# EasyEDA Pro project Macro Pad.eprj

# Schematic Schematic1
Create Date: 2024-01-24; Page Name: P1; Project Name: Macro Pad; Schematic Name: Schematic1; Update Date: 2024-02-12; Company: AVT; Drawn: Tiebe Groosman; Page Size: A4; Part Number: 001; Version: V0.1
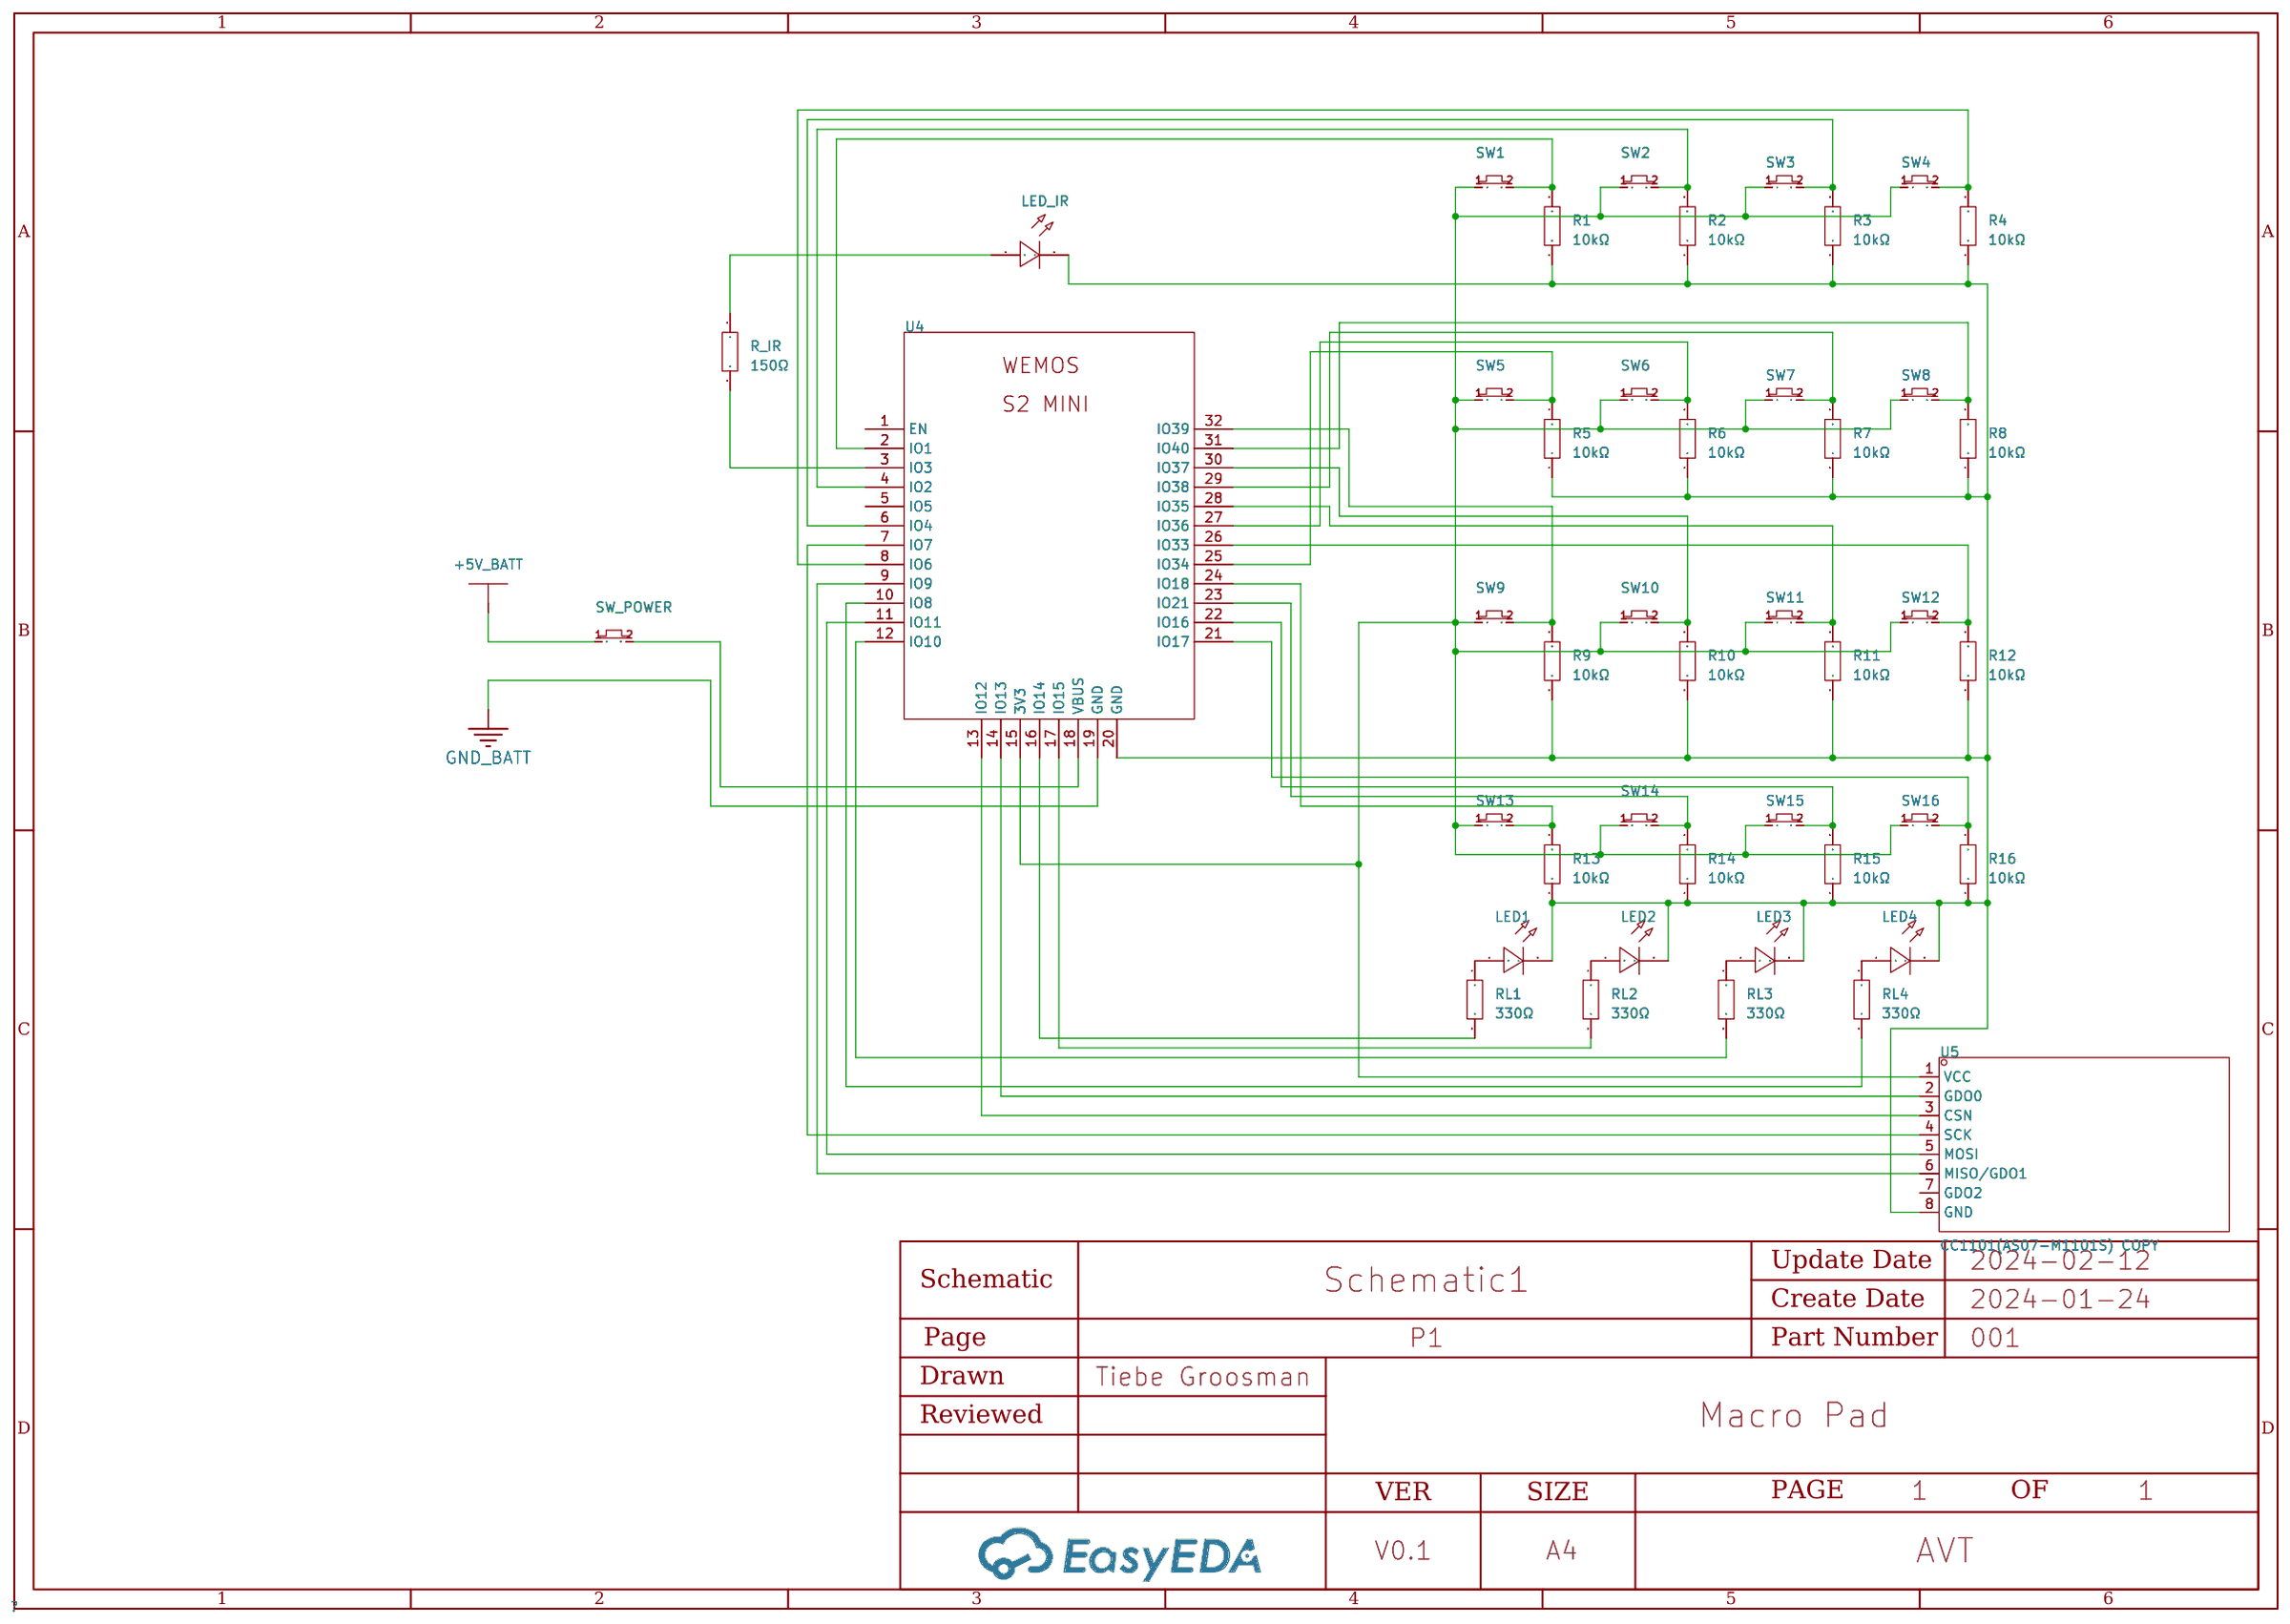
[diagram p0: schematic sheet]

## Parts
LED1  -  [LED-TH_BD5.8-P2.54-FD]
LED2  -  [LED-TH_BD5.8-P2.54-FD]
LED3  -  [LED-TH_BD5.8-P2.54-FD]
LED4  -  [LED-TH_BD5.8-P2.54-FD]
LED_IR  -  [LED-TH_BD5.8-P2.54-FD]
R1  10kΩ  [RES-TH_BD1.8-L3.2-P7.20-D0.4]
R2  10kΩ  [RES-TH_BD1.8-L3.2-P7.20-D0.4]
R3  10kΩ  [RES-TH_BD1.8-L3.2-P7.20-D0.4]
R4  10kΩ  [RES-TH_BD1.8-L3.2-P7.20-D0.4]
R5  10kΩ  [RES-TH_BD1.8-L3.2-P7.20-D0.4]
R6  10kΩ  [RES-TH_BD1.8-L3.2-P7.20-D0.4]
R7  10kΩ  [RES-TH_BD1.8-L3.2-P7.20-D0.4]
R8  10kΩ  [RES-TH_BD1.8-L3.2-P7.20-D0.4]
R9  10kΩ  [RES-TH_BD1.8-L3.2-P7.20-D0.4]
R10  10kΩ  [RES-TH_BD1.8-L3.2-P7.20-D0.4]
R11  10kΩ  [RES-TH_BD1.8-L3.2-P7.20-D0.4]
R12  10kΩ  [RES-TH_BD1.8-L3.2-P7.20-D0.4]
R13  10kΩ  [RES-TH_BD1.8-L3.2-P7.20-D0.4]
R14  10kΩ  [RES-TH_BD1.8-L3.2-P7.20-D0.4]
R15  10kΩ  [RES-TH_BD1.8-L3.2-P7.20-D0.4]
R16  10kΩ  [RES-TH_BD1.8-L3.2-P7.20-D0.4]
R_IR  150Ω  [RES-TH_BD1.8-L3.2-P7.20-D0.4]
RL1  330Ω  [RES-TH_BD1.8-L3.2-P7.20-D0.4]
RL2  330Ω  [RES-TH_BD1.8-L3.2-P7.20-D0.4]
RL3  330Ω  [RES-TH_BD1.8-L3.2-P7.20-D0.4]
RL4  330Ω  [RES-TH_BD1.8-L3.2-P7.20-D0.4]
SW1  BUTTON-2PIN COPY  [BUTTON-2PIN]
SW2  BUTTON-2PIN COPY  [BUTTON-2PIN]
SW3  BUTTON-2PIN COPY  [BUTTON-2PIN]
SW4  BUTTON-2PIN COPY  [BUTTON-2PIN]
SW5  BUTTON-2PIN COPY  [BUTTON-2PIN]
SW6  BUTTON-2PIN COPY  [BUTTON-2PIN]
SW7  BUTTON-2PIN COPY  [BUTTON-2PIN]
SW8  BUTTON-2PIN COPY  [BUTTON-2PIN]
SW9  BUTTON-2PIN COPY  [BUTTON-2PIN]
SW10  BUTTON-2PIN COPY  [BUTTON-2PIN]
SW11  BUTTON-2PIN COPY  [BUTTON-2PIN]
SW12  BUTTON-2PIN COPY  [BUTTON-2PIN]
SW13  BUTTON-2PIN COPY  [BUTTON-2PIN]
SW14  BUTTON-2PIN COPY  [BUTTON-2PIN]
SW15  BUTTON-2PIN COPY  [BUTTON-2PIN]
SW16  BUTTON-2PIN COPY  [BUTTON-2PIN]
SW_POWER  BUTTON-2PIN COPY  [BUTTON-2PIN]
U4  WEMOS S2 MINI COPY  [WEMOS-S2-MINI]
U5  CC1101(AS07-M1101S) COPY  [CC1101(AS07-M1101S)]

## Library data of the parts
LED1-LED4 LED_IR = LED_TH-R_5mm: Supplier Footprint: Through
R1-R16 R_IR RL1-RL4 = Res_AXIAL-1/8W: Supplier Footprint: Through
SW1-SW16 SW_POWER = BUTTON-2PIN COPY: Supplier Part: C71836; Manufacturer: BBJ; Manufacturer Part: Switch,6*6*6Plastic head,260G, 0.25mm,Straight line
U4 = WEMOS S2 MINI COPY: Manufacturer: WEMOS; Manufacturer Part: Wemos; Supplier: WEMOS; Supplier Part: WEMOS_S2_MINI; link: https://www.wemos.cc/en/latest/s2/s2_mini.html?spm=a2g0o.detail.1000023.1.36da1596ZoDwKF
U5 = CC1101(AS07-M1101S) COPY

## Nets
+5V_BATT: SW_POWER.1
GND_BATT: U4.19(GND)
$1N13801: LED_IR.1(C) R_IR.1
$1N17024: LED1.1(C) RL1.1
$1N17244: LED2.1(C) RL2.1
$1N17270: LED3.1(C) RL3.1
$1N17296: LED4.1(C) RL4.1
Net-(LED1-2): LED1.2(A) LED2.2(A) LED3.2(A) LED4.2(A) LED_IR.2(A) R1.1 R2.1 R3.1 R4.1 R5.1 R6.1 R7.1 R8.1 R9.1 R10.1 R11.1 R12.1 R13.1 R14.1 R15.1 R16.1 U4.20(GND) U5.8(GND)
Net-(R1-2): R1.2 SW1.2(3) U4.2(IO1)
Net-(R2-2): R2.2 SW2.2(3) U4.4(IO2)
Net-(R3-2): R3.2 SW3.2(3) U4.6(IO4)
Net-(R4-2): R4.2 SW4.2(3) U4.8(IO6)
Net-(R5-2): R5.2 SW5.2(3) U4.25(IO34)
Net-(R6-2): R6.2 SW6.2(3) U4.27(IO36)
Net-(R7-2): R7.2 SW7.2(3) U4.29(IO38)
Net-(R8-2): R8.2 SW8.2(3) U4.31(IO40)
Net-(R9-2): R9.2 SW9.2(3) U4.32(IO39)
Net-(R10-2): R10.2 SW10.2(3) U4.30(IO37)
Net-(R11-2): R11.2 SW11.2(3) U4.28(IO35)
Net-(R12-2): R12.2 SW12.2(3) U4.26(IO33)
Net-(R13-2): R13.2 SW13.2(3) U4.24(IO18)
Net-(R14-2): R14.2 SW14.2(3) U4.23(IO21)
Net-(R15-2): R15.2 SW15.2(3) U4.22(IO16)
Net-(R16-2): R16.2 SW16.2(3) U4.21(IO17)
Net-(R_IR-2): R_IR.2 U4.3(IO3)
Net-(RL1-2): RL1.2 U4.16(IO14)
Net-(RL2-2): RL2.2 U4.17(IO15)
Net-(RL3-2): RL3.2 U4.12(IO10)
Net-(RL4-2): RL4.2 U4.10(IO8)
Net-(SW1-1): SW1.1 SW2.1 SW3.1 SW4.1 SW5.1 SW6.1 SW7.1 SW8.1 SW9.1 SW10.1 SW11.1 SW12.1 SW13.1 SW14.1 SW15.1 SW16.1 U4.15(3V3) U5.1(VCC)
Net-(SW_POWER-2): SW_POWER.2(3) U4.18(VBUS)
Net-(U4-7): U4.7(IO7) U5.4(SCK)
Net-(U4-9): U4.9(IO9) U5.6(MISO/GDO1)
Net-(U4-11): U4.11(IO11) U5.5(MOSI)
Net-(U4-13): U4.13(IO12) U5.3(CSN)
Net-(U4-14): U4.14(IO13) U5.2(GDO0)

Not connected (* = marked no-connect by the designer): U4 1(EN) 5(IO5); U5 7(GDO2)

# Board PCB3
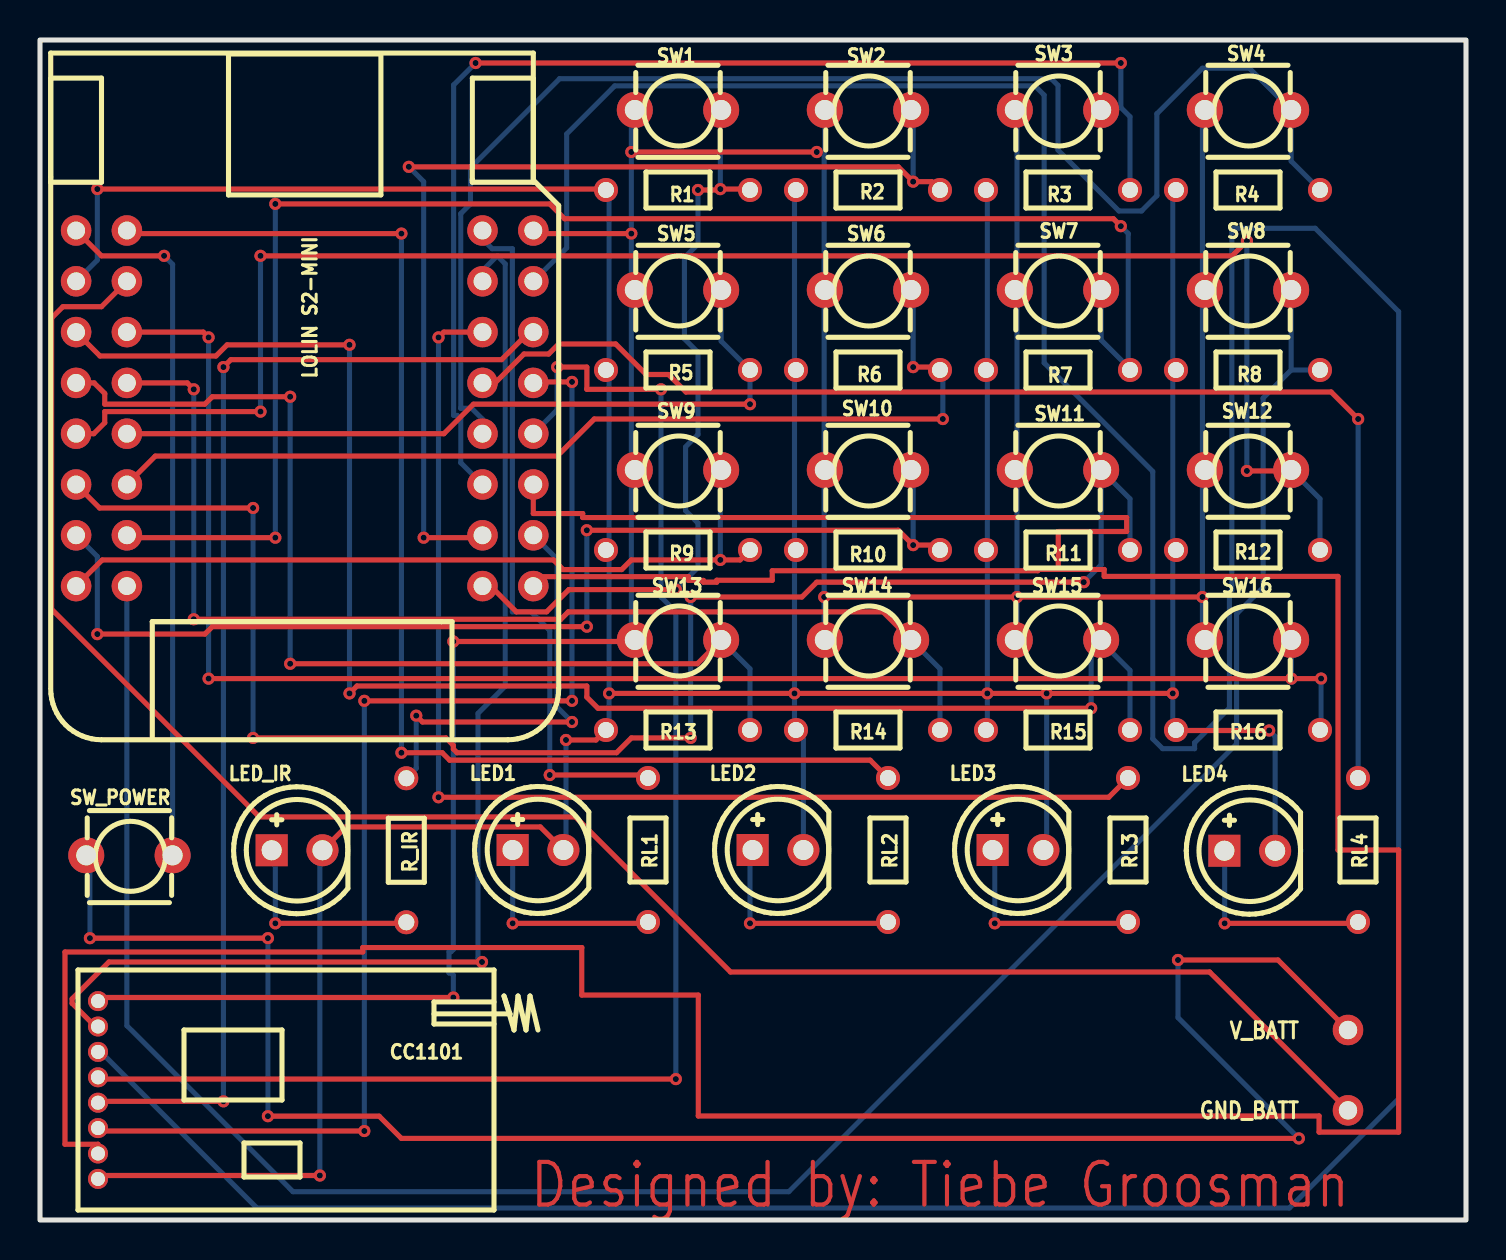
[diagram p1: board, top side]
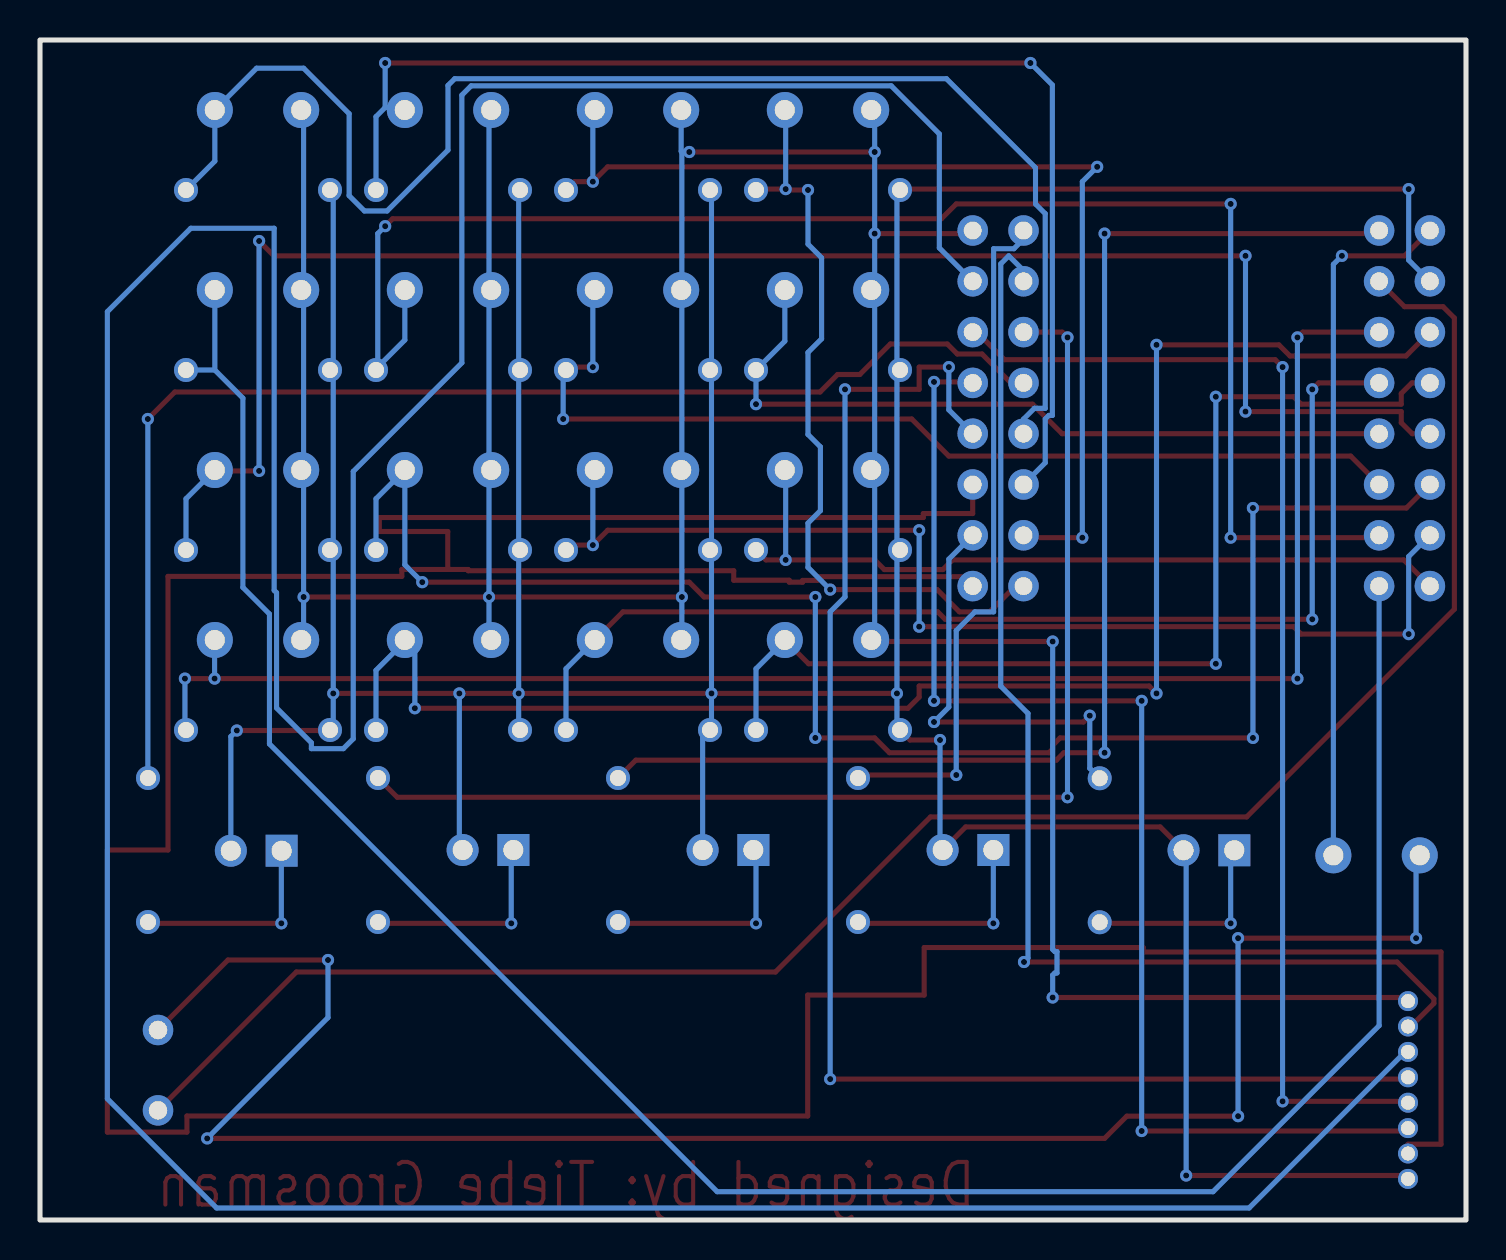
[diagram p2: board, bottom side, seen from below]

Outline 71.3 x 59 mm; copper layers: Top Layer, Bottom Layer. Coordinates in mm from the lower left corner of the outline.
Outline path: rectangle 0,59 71.3,0
Stack: Top Layer 0.035mm / Dielectric1 1.51mm FR4 er 4.5 / Bottom Layer 0.035mm

## Design rules (mm)
template: JLCPCB Capability(Two Layers Board)
spacing copperThickness1oz (default): track to track 0.102, other pairs 0.152 to 0.3
spacing copperThickness2oz: track to track 0.203, other pairs 0.152 to 0.3
track width copperThickness1oz (default): min 0.127, default 0.254, max 2.54
track width copperThickness2oz: min 0.203, default 0.254, max 2.54
differential pair differentialPair (default): width min 0.127, default 0.254, max 2.54; gap min 0.152, default 0.152
via viaSize (default): diameter min 0.5, default 0.61, max 10; hole min 0.3, default 0.305, max 6.3

## Placement (name value [footprint] x y rotation side)
CC1101  CC1101(AS07-M1101S) COPY  [CC1101(AS07-M1101S)]  2.9 6.5 0 top
LED1  -  [LED-TH_BD5.8-P2.54-FD]  24.9 18.5 0 top
LED2  -  [LED-TH_BD5.8-P2.54-FD]  36.9 18.5 0 top
LED3  -  [LED-TH_BD5.8-P2.54-FD]  48.9 18.5 0 top
LED4  -  [LED-TH_BD5.8-P2.54-FD]  60.49 18.46 0 top
LED_IR  -  [LED-TH_BD5.8-P2.54-FD]  12.85 18.49 0 top
LOLIN S2-MINI  WEMOS S2 MINI COPY  [WEMOS-S2-MINI]  13.23 39.06 180 top
NOREF  -  [Pad_e85]  65.4 9.5 0 top
NOREF#2  -  [Pad_e86]  65.4 5.48 0 top
R1  10kΩ  [RES-TH_BD1.8-L3.2-P7.20-D0.4]  31.9 51.5 0 top
R2  10kΩ  [RES-TH_BD1.8-L3.2-P7.20-D0.4]  41.4 51.5 0 top
R3  10kΩ  [RES-TH_BD1.8-L3.2-P7.20-D0.4]  50.9 51.5 0 top
R4  10kΩ  [RES-TH_BD1.8-L3.2-P7.20-D0.4]  60.4 51.5 0 top
R5  10kΩ  [RES-TH_BD1.8-L3.2-P7.20-D0.4]  31.9 42.5 0 top
R6  10kΩ  [RES-TH_BD1.8-L3.2-P7.20-D0.4]  41.4 42.5 0 top
R7  10kΩ  [RES-TH_BD1.8-L3.2-P7.20-D0.4]  50.9 42.5 0 top
R8  10kΩ  [RES-TH_BD1.8-L3.2-P7.20-D0.4]  60.4 42.5 0 top
R9  10kΩ  [RES-TH_BD1.8-L3.2-P7.20-D0.4]  31.9 33.5 0 top
R10  10kΩ  [RES-TH_BD1.8-L3.2-P7.20-D0.4]  41.4 33.5 0 top
R11  10kΩ  [RES-TH_BD1.8-L3.2-P7.20-D0.4]  50.9 33.5 0 top
R12  10kΩ  [RES-TH_BD1.8-L3.2-P7.20-D0.4]  60.4 33.5 0 top
R13  10kΩ  [RES-TH_BD1.8-L3.2-P7.20-D0.4]  31.9 24.5 0 top
R14  10kΩ  [RES-TH_BD1.8-L3.2-P7.20-D0.4]  41.4 24.5 0 top
R15  10kΩ  [RES-TH_BD1.8-L3.2-P7.20-D0.4]  50.9 24.5 0 top
R16  10kΩ  [RES-TH_BD1.8-L3.2-P7.20-D0.4]  60.4 24.5 0 top
R_IR  150Ω  [RES-TH_BD1.8-L3.2-P7.20-D0.4]  18.31 18.49 90 top
RL1  330Ω  [RES-TH_BD1.8-L3.2-P7.20-D0.4]  30.4 18.5 90 top
RL2  330Ω  [RES-TH_BD1.8-L3.2-P7.20-D0.4]  42.4 18.5 90 top
RL3  330Ω  [RES-TH_BD1.8-L3.2-P7.20-D0.4]  54.4 18.5 90 top
RL4  330Ω  [RES-TH_BD1.8-L3.2-P7.20-D0.4]  65.9 18.5 90 top
SW1  BUTTON-2PIN COPY  [BUTTON-2PIN]  31.9 55.5 0 top
SW2  BUTTON-2PIN COPY  [BUTTON-2PIN]  41.4 55.5 0 top
SW3  BUTTON-2PIN COPY  [BUTTON-2PIN]  50.9 55.5 0 top
SW4  BUTTON-2PIN COPY  [BUTTON-2PIN]  60.4 55.5 0 top
SW5  BUTTON-2PIN COPY  [BUTTON-2PIN]  31.9 46.5 0 top
SW6  BUTTON-2PIN COPY  [BUTTON-2PIN]  41.4 46.5 0 top
SW7  BUTTON-2PIN COPY  [BUTTON-2PIN]  50.9 46.5 0 top
SW8  BUTTON-2PIN COPY  [BUTTON-2PIN]  60.4 46.5 0 top
SW9  BUTTON-2PIN COPY  [BUTTON-2PIN]  31.9 37.5 0 top
SW10  BUTTON-2PIN COPY  [BUTTON-2PIN]  41.4 37.5 0 top
SW11  BUTTON-2PIN COPY  [BUTTON-2PIN]  50.9 37.5 0 top
SW12  BUTTON-2PIN COPY  [BUTTON-2PIN]  60.4 37.5 0 top
SW13  BUTTON-2PIN COPY  [BUTTON-2PIN]  31.9 29 0 top
SW14  BUTTON-2PIN COPY  [BUTTON-2PIN]  41.4 29 0 top
SW15  BUTTON-2PIN COPY  [BUTTON-2PIN]  50.9 29 0 top
SW16  BUTTON-2PIN COPY  [BUTTON-2PIN]  60.4 29 0 top
SW_POWER  BUTTON-2PIN COPY  [BUTTON-2PIN]  4.47 18.23 0 top

## Footprints (pads in the part's own frame, mm; a bottom-side part is the same pattern mirrored in y, then rotated)
BUTTON-2PIN
  round 1.8 hole 1: 1(-2.159,0) 2(2.159,0)
CC1101(AS07-M1101S)
  round 1 hole 0.7: 1(0,4.445) 2(0,3.175) 3(0,1.905) 4(0,0.635) 5(0,-0.635) 6(0,-1.905) 7(0,-3.175) 8(0,-4.445)
LED-TH_BD5.8-P2.54-FD
  rect 1.6x1.6 hole 1: 1(-1.27,0)
  round 1.6 hole 1: 2(1.27,0)
Pad_e85
  round 1.524 hole 0.914: 1(0,0)
Pad_e86
  round 1.524 hole 0.914: 34(0,0)
RES-TH_BD1.8-L3.2-P7.20-D0.4
  round 1.2 hole 0.8: 1(-3.6,0) 2(3.6,0)
WEMOS-S2-MINI
  round 1.524 hole 0.889: 1(-11.43,7.366) 2(-8.89,7.366) 3(-11.43,4.826) 4(-8.89,4.826) 5(-11.43,2.286) 6(-8.89,2.286) 7(-11.43,-0.254) 8(-8.89,-0.254) 9(-11.43,-2.794) 10(-8.89,-2.794) 11(-11.43,-5.334) 12(-8.89,-5.334) 13(-11.43,-7.874) 14(-8.89,-7.874) 15(-11.43,-10.414) 16(-8.89,-10.414) 17(8.89,-10.414) 18(11.43,-10.414) 19(8.89,-7.874) 20(11.43,-7.874) 21(8.89,-5.334) 22(11.43,-5.334) 23(8.89,-2.794) 24(11.43,-2.794) 25(8.89,-0.254) 26(11.43,-0.254) 27(8.89,2.286) 28(11.43,2.286) 29(8.89,4.826) 30(11.43,4.826) 31(8.89,7.366) 32(11.43,7.366)

## Nets
+5V_BATT: NOREF.1 SW_POWER.1
GND_BATT: LOLIN S2-MINI.19 NOREF#2.34
$1N7799: LOLIN S2-MINI.4 R2.2 SW2.2
$1N9635: LOLIN S2-MINI.2 R1.2 SW1.2
$1N11708: LOLIN S2-MINI.8 R4.2 SW4.2
$1N11715: LOLIN S2-MINI.6 R3.2 SW3.2
$1N12469: LOLIN S2-MINI.27 R6.2 SW6.2
$1N12477: LOLIN S2-MINI.25 R5.2 SW5.2
$1N12492: LOLIN S2-MINI.31 R8.2 SW8.2
$1N12495: LOLIN S2-MINI.29 R7.2 SW7.2
$1N13243: LOLIN S2-MINI.30 R10.2 SW10.2
$1N13251: LOLIN S2-MINI.32 R9.2 SW9.2
$1N13266: LOLIN S2-MINI.26 R12.2 SW12.2
$1N13269: LOLIN S2-MINI.28 R11.2 SW11.2
$1N13801: LED_IR.1 R_IR.1
$1N13802: LOLIN S2-MINI.3 R_IR.2
$1N14432: LOLIN S2-MINI.18 SW_POWER.2
$1N15226: CC1101.2 LOLIN S2-MINI.14
$1N15246: CC1101.3 LOLIN S2-MINI.13
$1N15263: CC1101.4 LOLIN S2-MINI.7
$1N15276: CC1101.5 LOLIN S2-MINI.11
$1N15287: CC1101.6 LOLIN S2-MINI.9
$1N16205: CC1101.1 LOLIN S2-MINI.15 SW1.1 SW2.1 SW3.1 SW4.1 SW5.1 SW6.1 SW7.1 SW8.1 SW9.1 SW10.1 SW11.1 SW12.1 SW13.1 SW14.1 SW15.1 SW16.1
$1N16367: LOLIN S2-MINI.24 R13.2 SW13.2
$1N16374: LOLIN S2-MINI.23 R14.2 SW14.2
$1N16381: LOLIN S2-MINI.22 R15.2 SW15.2
$1N16388: LOLIN S2-MINI.21 R16.2 SW16.2
$1N17024: LED1.1 RL1.1
$1N17106: LOLIN S2-MINI.16 RL1.2
$1N17110: LOLIN S2-MINI.17 RL2.2
$1N17210: LOLIN S2-MINI.12 RL3.2
$1N17216: LOLIN S2-MINI.10 RL4.2
$1N17244: LED2.1 RL2.1
$1N17270: LED3.1 RL3.1
$1N17296: LED4.1 RL4.1
$1N17346: CC1101.8 LED1.2 LED2.2 LED3.2 LED4.2 LED_IR.2 LOLIN S2-MINI.20 R1.1 R2.1 R3.1 R4.1 R5.1 R6.1 R7.1 R8.1 R9.1 R10.1 R11.1 R12.1 R13.1 R14.1 R15.1 R16.1

Pads without a net: CC1101 7; LOLIN S2-MINI 1 5

## Via types
v1: diameter 0.61, hole 0.305, Top Layer to Bottom Layer, 85 vias

## Routing (per net, layer and track width the routed paths; a pad name or vN(x,y) marks a point on that pad's centre or on a via; arc(x,y) is an arc through that point)
+5V_BATT: length 95.4
  Top Layer w0.254: v1(11.4,5.19) 16.96,5.19 18.07,4.08 v1(62.94,4.08) ; NOREF.1 61.9,13 v1(56.9,13) ; v1(11.4,14.09) v1(2.5,14.09)
  Bottom Layer w0.254: v1(11.4,5.19) v1(11.4,14.09) ; v1(62.94,4.08) 56.9,10.12 v1(56.9,13) ; v1(2.5,14.09) 2.5,18.05 SW_POWER.1
GND_BATT: length 94.3
  Top Layer w0.254: LOLIN S2-MINI.19 3.08,45.67 1.15,45.67 0.58,45.1 0.58,30.54 10.97,20.15 26.77,20.15 34.53,12.4 58.48,12.4 NOREF#2.34
(no net): length 198
  Top Layer w0.254: LOLIN S2-MINI.1 24.66,32.17 32.43,32.17 32.43,31.98 33.17,31.98 33.17,31.89 33.84,31.89 33.84,31.99 36.61,31.99 36.61,32.46 49.89,32.46 49.89,32.53 50.91,32.53 ; 50.91,32.53 53.21,32.53 53.21,32.18 64.9,32.18 64.9,18.5 67.93,18.5 67.93,4.4 63.95,4.4 63.95,5.2 32.91,5.2 32.91,11.25 27.09,11.25 27.09,13.62 16.14,13.62 16.14,13.4 1.25,13.4 1.25,3.79 2.9,3.79 CC1101.7 ; 50.91,32.53 50.91,34.42 54.33,34.42 54.33,35.12 27.13,35.12 27.13,35.32 24.66,35.32 LOLIN S2-MINI.5
$1N7799: length 52.5
  Top Layer w0.254: R2.2 44.58,51.92 v1(43.66,51.92) 42.92,52.66 v1(18.44,52.66) ; v1(19.18,34.12) 22.01,34.12 LOLIN S2-MINI.4
  Bottom Layer w0.254: v1(18.44,52.66) 19.18,51.92 v1(19.18,34.12) ; SW2.2 43.66,55.4 v1(43.66,51.92)
$1N9635: length 38.8
  Top Layer w0.254: LOLIN S2-MINI.2 22.53,31.69 23.82,30.41 25.33,30.41 26.44,31.52 v1(31.79,31.52) ; v1(32.9,51.5) 33.97,51.5 v1(34.02,51.55) 35.45,51.55 R1.2
  Bottom Layer w0.254: SW1.2 34.02,55.46 v1(34.02,51.55) ; v1(32.9,51.5) 32.9,48.79 32.22,48.11 32.22,44.06 32.9,43.38 32.9,39.28 32.28,38.66 32.28,35.47 32.9,34.84 32.9,32.63 v1(31.79,31.52)
$1N11708: length 72.6
  Bottom Layer w0.254: LOLIN S2-MINI.8 22.12,40.04 21.58,40.58 21.04,40.58 21.04,50.32 21.52,50.8 21.52,52.61 25.98,57.06 50.56,57.06 50.9,56.73 50.9,53.5 53.95,50.45 55.08,50.45 55.84,51.22 55.84,55.31 58.12,57.59 60.47,57.59 SW4.2 62.56,52.94 R4.2
$1N11715: length 62.1
  Top Layer w0.254: v1(54.04,57.85) v1(21.78,57.85)
  Bottom Layer w0.254: 54.04,55.62 53.18,55.62 SW3.2 ; 54.04,55.62 54.5,55.17 R3.2 ; 54.04,55.62 v1(54.04,57.85) ; LOLIN S2-MINI.6 21.04,37.86 21.04,40.05 20.86,40.23 20.68,40.23 20.68,56.75 v1(21.78,57.85)
$1N12469: length 50
  Top Layer w0.254: v1(45.14,40.05) 27.71,40.05 25.86,38.2 5.77,38.2 LOLIN S2-MINI.27 ; R6.2 44.85,42.65 v1(43.66,42.65)
  Bottom Layer w0.254: v1(43.66,42.65) 43.66,46.4 SW6.2 ; v1(45.14,40.05) 45.14,42.36 R6.2
$1N12477: length 38.1
  Top Layer w0.254: LOLIN S2-MINI.25 20.2,39.31 21.67,40.79 v1(35.5,40.79)
  Bottom Layer w0.254: SW5.2 34.06,43.94 R5.2 v1(35.5,40.79)
$1N12492: length 115.4
  Bottom Layer w0.254: LOLIN S2-MINI.31 4.34,9.72 12.65,1.41 37.44,1.41 59.83,23.8 59.83,30.3 61.16,31.63 61.16,41.1 62.56,42.5 ; 62.56,42.5 SW8.2 ; 62.56,42.5 R8.2
$1N12495: length 78.7
  Top Layer w0.254: LOLIN S2-MINI.29 4.46,34.12 v1(11.77,34.12) ; v1(54.04,49.69) 53.67,50.06 26.23,50.06 25.49,50.8 v1(11.77,50.8)
  Bottom Layer w0.254: SW7.2 53.06,44 54.41,42.65 ; v1(54.04,49.69) 54.41,49.32 54.41,42.65 ; v1(11.77,50.8) v1(11.77,34.12) ; 54.41,42.65 54.5,42.56 R7.2
$1N13243: length 56.7
  Top Layer w0.254: v1(27.34,29.67) 8.61,29.67 8.24,29.3 v1(2.87,29.3) ; v1(27.34,34.49) 42.92,34.49 v1(43.66,33.75) 44.75,33.75 R10.2
  Bottom Layer w0.254: v1(27.34,34.49) v1(27.34,29.67) ; v1(2.87,29.3) 2.87,33.17 LOLIN S2-MINI.30 ; v1(43.66,33.75) 43.66,37.4 SW10.2
$1N13251: length 39.4
  Top Layer w0.254: LOLIN S2-MINI.32 3.11,33 25.67,33 26.16,32.52 29.08,32.52 29.57,33 v1(34.02,33) 35,33 R9.2
  Bottom Layer w0.254: v1(34.02,33) 34.02,37.46 SW9.2
$1N13266: length 85.7
  Top Layer w0.254: v1(11.03,48.21) 59.6,48.21 v1(60.35,48.95) ; SW12.2 62.51,37.45 v1(60.35,37.45) ; LOLIN S2-MINI.26 2.69,39.31 3.24,39.86 3.24,40.42 v1(11.03,40.42)
  Bottom Layer w0.254: v1(60.35,37.45) v1(60.35,48.95) ; SW12.2 64,36.06 R12.2 ; v1(11.03,48.21) v1(11.03,40.42)
$1N13269: length 81
  Top Layer w0.254: v1(32.53,31.15) 38.1,31.15 38.84,31.89 v1(52.19,31.89) ; v1(10.65,24.1) 20.3,24.1 20.67,23.73 20.67,23.55 20.85,23.36 28.83,23.36 29.57,24.1 v1(32.53,24.1) ; v1(10.65,35.6) 2.98,35.6 LOLIN S2-MINI.28
  Bottom Layer w0.254: v1(32.53,31.15) v1(32.53,24.1) ; R11.2 54.5,36.06 SW11.2 53.06,32.76 v1(52.19,31.89) ; v1(10.65,24.1) v1(10.65,35.6)
$1N13801: length 10.3
  Top Layer w0.254: R_IR.1 18.26,14.83 v1(11.77,14.83)
  Bottom Layer w0.254: LED_IR.1 11.77,18.3 v1(11.77,14.83)
$1N13802: length 21.4
  Top Layer w0.254: v1(26.6,24.9) 19.13,24.9 v1(18.81,25.22)
  Bottom Layer w0.254: LOLIN S2-MINI.3 25.86,33.04 25.86,25.64 v1(26.6,24.9) ; 18.31,22.09 18.81,22.58 v1(18.81,25.22)
$1N14432: length 35.1
  Top Layer w0.254: LOLIN S2-MINI.18 3.07,48.21 v1(6.2,48.21)
  Bottom Layer w0.254: v1(6.2,48.21) 6.63,47.78 SW_POWER.2
$1N15226: length 61
  Top Layer w0.254: CC1101.2 2.76,9.68 1.61,10.83 1.61,11.06 3.45,12.9 v1(22.1,12.9)
  Bottom Layer w0.254: LOLIN S2-MINI.14 22.12,47.47 22.86,48.21 23.26,47.8 23.26,26.69 21.9,25.33 21.9,13.1 v1(22.1,12.9)
$1N15246: length 216.6
  Bottom Layer w0.254: CC1101.3 3.04,8.41 10.84,0.6 62.47,0.6 67.93,6.06 67.93,45.42 63.76,49.59 59.59,49.59 59.59,31.48 59.47,31.36 59.47,25.6 57.73,23.86 57.73,23.57 56.13,23.57 55.64,24.06 55.64,37.43 50.21,42.86 50.21,56.24 49.74,56.71 28.74,56.71 26.33,54.3 26.33,48.6 LOLIN S2-MINI.13
$1N15263: length 73.9
  Top Layer w0.254: v1(31.79,7.05) 2.99,7.05 CC1101.4 ; v1(25.86,42.65) 27.34,42.65 27.34,41.53 v1(31.05,41.53)
  Bottom Layer w0.254: v1(31.05,41.53) 31.05,31.15 31.79,30.41 v1(31.79,7.05) ; v1(25.86,42.65) 25.86,40.51 LOLIN S2-MINI.7
$1N15276: length 59.2
  Top Layer w0.254: LOLIN S2-MINI.11 24.46,44.39 23.08,43.02 9.54,43.02 v1(9.17,42.65) ; CC1101.5 2.97,5.93 v1(9.17,5.93)
  Bottom Layer w0.254: v1(9.17,42.65) v1(9.17,5.93)
$1N15287: length 63.2
  Top Layer w0.254: LOLIN S2-MINI.9 24.71,41.9 v1(26.6,41.9) ; CC1101.6 3.05,4.45 v1(16.22,4.45) ; v1(26.6,25.96) v1(16.22,25.96)
  Bottom Layer w0.254: v1(26.6,41.9) v1(26.6,25.96) ; v1(16.22,25.96) v1(16.22,4.45)
$1N16205: length 185.8
  Top Layer w0.254: v1(58.12,31.15) v1(48.85,31.15) v1(39.21,31.15) ; SW13.1 29.67,28.92 v1(20.67,28.92) ; v1(20.67,11.12) 3.08,11.12 CC1101.1 ; v1(29.57,49.32) 24.82,49.32 LOLIN S2-MINI.15 ; v1(38.84,53.4) v1(29.57,53.4)
  Bottom Layer w0.254: 58.12,37.5 v1(58.12,31.15) 58.12,29.12 SW16.1 ; 58.12,37.5 SW12.1 ; 58.12,37.5 58.12,46.5 ; SW1.1 29.57,55.33 v1(29.57,53.4) v1(29.57,49.32) 29.57,46.5 ; 48.85,46.5 48.85,37.5 ; 48.85,46.5 SW7.1 ; 48.85,46.5 48.85,55.39 SW3.1 ; 48.85,37.5 v1(48.85,31.15) 48.85,29.11 SW15.1 ; 48.85,37.5 SW11.1 ; 39.21,37.5 v1(39.21,31.15) 39.21,29.03 SW14.1 ; 39.21,37.5 39.21,46.5 ; 39.21,37.5 SW10.1 ; SW2.1 39.24,53.43 39.21,53.4 ; v1(20.67,28.92) 20.67,13.53 20.56,13.42 20.45,13.42 20.45,12.35 20.56,12.35 20.67,12.24 v1(20.67,11.12) ; SW8.1 58.12,46.5 ; 58.12,46.5 58.12,55.38 SW4.1 ; SW13.1 29.57,29.17 29.57,37.5 ; SW9.1 29.57,37.5 ; 29.57,37.5 29.57,46.5 ; SW6.1 39.21,46.5 ; 39.21,46.5 39.21,53.4 ; 39.21,53.4 v1(38.84,53.4) ; 29.57,46.5 SW5.1
$1N16367: length 52.1
  Top Layer w0.254: SW13.2 32.87,27.81 v1(12.51,27.81) ; v1(12.51,41.16) 8.61,41.16 8.24,40.79 3.24,40.79 3.24,41.32 2.71,41.86 LOLIN S2-MINI.24
  Bottom Layer w0.254: SW13.2 35.5,27.56 R13.2 ; v1(12.51,27.81) v1(12.51,41.16)
$1N16374: length 56.7
  Top Layer w0.254: v1(7.69,41.53) 7.37,41.86 LOLIN S2-MINI.23 ; v1(7.69,30.04) 26.04,30.04 26.41,30.41 42.15,30.41 SW14.2
  Bottom Layer w0.254: R14.2 45,27.56 SW14.2 ; v1(7.69,30.04) v1(7.69,41.53)
$1N16381: length 78.5
  Top Layer w0.254: v1(15.48,43.76) 9.36,43.76 8.8,43.2 3,43.2 LOLIN S2-MINI.22 ; v1(52.56,25.59) 27.9,25.59 27.34,26.14 27.34,26.7 15.85,26.7 v1(15.48,26.33)
  Bottom Layer w0.254: R15.2 54.5,27.48 53.06,28.92 ; v1(15.48,26.33) v1(15.48,43.76) ; 53.06,28.92 SW15.2 ; 53.06,28.92 52.56,28.42 v1(52.56,25.59)
$1N16388: length 81.4
  Top Layer w0.254: v1(8.43,27.07) v1(62.57,27.07) v1(64.05,27.07) ; LOLIN S2-MINI.21 8.16,44.39 v1(8.43,44.13)
  Bottom Layer w0.254: R16.2 64.05,24.55 v1(64.05,27.07) ; SW16.2 62.57,28.99 v1(62.57,27.07) ; v1(8.43,27.07) v1(8.43,44.13)
$1N17024: length 10.5
  Top Layer w0.254: RL1.1 30.33,14.83 v1(23.63,14.83)
  Bottom Layer w0.254: v1(23.63,14.83) 23.63,18.5 LED1.1
$1N17106: length 34.7
  Top Layer w0.254: RL1.2 30.25,22.25 v1(25.49,22.25)
  Bottom Layer w0.254: LOLIN S2-MINI.16 22.12,49.04 22.61,48.56 23.62,48.56 23.62,30.41 24.55,30.41 25.49,29.47 v1(25.49,22.25)
$1N17110: length 64.6
  Top Layer w0.254: LOLIN S2-MINI.17 4.5,49.32 v1(18.07,49.32) ; RL2.2 41.51,22.99 20.48,22.99 20.11,23.36 v1(18.07,23.36)
  Bottom Layer w0.254: v1(18.07,23.36) v1(18.07,49.32)
$1N17210: length 60.2
  Top Layer w0.254: v1(19.93,44.13) 20.19,44.39 LOLIN S2-MINI.12 ; v1(19.93,21.14) 53.44,21.14 RL3.2
  Bottom Layer w0.254: v1(19.93,21.14) v1(19.93,44.13)
$1N17216: length 64.1
  Top Layer w0.254: v1(65.91,40.05) 64.56,41.4 32.3,41.4 31.42,42.28 30.31,42.28 28.78,43.8 25.93,43.8 25.43,43.3 24.2,43.3 22.75,41.86 LOLIN S2-MINI.10
  Bottom Layer w0.254: v1(65.91,40.05) 65.91,22.11 RL4.2
$1N17244: length 10.6
  Top Layer w0.254: RL2.1 42.33,14.83 v1(35.5,14.83)
  Bottom Layer w0.254: LED2.1 35.5,18.37 v1(35.5,14.83)
$1N17270: length 10.4
  Top Layer w0.254: RL3.1 54.33,14.83 v1(47.74,14.83)
  Bottom Layer w0.254: v1(47.74,14.83) 47.74,18.39 LED3.1
$1N17296: length 10.3
  Top Layer w0.254: RL4.1 65.83,14.83 v1(59.23,14.83)
  Bottom Layer w0.254: v1(59.23,14.83) 59.23,18.45 LED4.1
$1N17346: length 241.1
  Top Layer w0.254: LED1.2 25.02,19.65 15.29,19.65 LED_IR.2 ; CC1101.8 3.07,2.22 v1(13.99,2.22) ; v1(2.87,51.55) 28.25,51.55 R1.1 ; v1(61.46,24.47) 56.83,24.47 R16.1 ; v1(28.45,26.33) v1(37.72,26.33) v1(47.37,26.33) v1(50.33,26.33) v1(56.64,26.33) ; R13.1 27.8,24 v1(26.3,24)
  Bottom Layer w0.254: LOLIN S2-MINI.20 2.87,48 v1(2.87,51.55) ; LED1.2 26.3,18.63 v1(26.3,24) ; R10.1 37.72,33.5 ; 37.72,33.5 37.72,42.5 ; 37.72,33.5 v1(37.72,26.33) 37.72,24.58 R14.1 38.17,24.13 LED2.2 ; 47.37,42.5 47.37,33.5 ; 47.37,42.5 47.37,51.43 R3.1 ; 47.37,42.5 R7.1 ; 47.37,33.5 R11.1 ; 47.37,33.5 v1(47.37,26.33) 47.37,24.57 R15.1 ; 56.64,42.5 56.64,33.5 ; 56.64,42.5 56.64,51.34 R4.1 ; 56.64,42.5 R8.1 ; 56.64,33.5 v1(56.64,26.33) 56.64,24.66 R16.1 ; 56.64,33.5 R12.1 ; 37.72,42.5 37.72,51.42 R2.1 ; 37.72,42.5 R6.1 ; 28.45,33.5 v1(28.45,26.33) 28.45,24.65 R13.1 ; 28.45,33.5 R9.1 ; 28.45,33.5 28.45,42.5 ; LED3.2 50.33,18.66 v1(50.33,26.33) ; LED4.2 61.76,24.17 v1(61.46,24.47) ; 28.45,42.5 28.45,51.35 R1.1 ; 28.45,42.5 R5.1 ; v1(13.99,2.22) 13.99,18.35 LED_IR.2

## Text on the board
Top Layer: Designed by: Tiebe Groosman
Top Silkscreen Layer: GND_BATT | V_BATT
